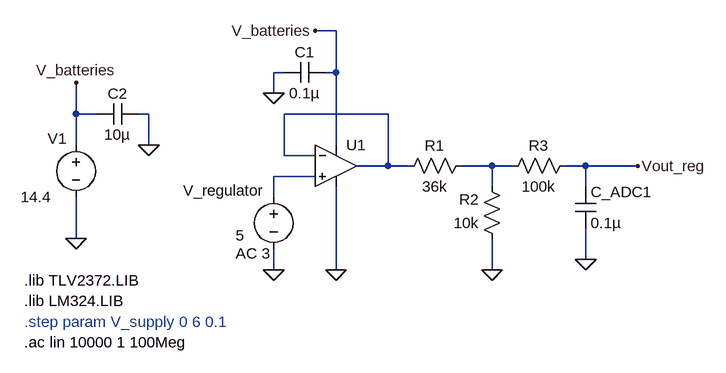
[diagram p0: schematic voltage_meaurementSINGLEregulator_optimised.asc]
voltage_meaurementSINGLEregulator_optimised.asc, the LTspice schematic file:
Version 4
SHEET 1 988 680
WIRE 256 -80 224 -80
WIRE 176 -16 160 -16
WIRE 256 -16 256 -80
WIRE 256 -16 240 -16
WIRE 160 16 160 -16
WIRE -144 48 -144 0
WIRE -112 48 -144 48
WIRE -32 48 -48 48
WIRE 336 48 176 48
WIRE -144 96 -144 48
WIRE -32 96 -32 48
WIRE 256 96 256 -16
WIRE 176 112 176 48
WIRE 224 112 176 112
WIRE 336 128 336 48
WIRE 336 128 288 128
WIRE 368 128 336 128
WIRE 496 128 448 128
WIRE 528 128 496 128
WIRE 640 128 608 128
WIRE 720 128 640 128
WIRE 224 144 160 144
WIRE 496 160 496 128
WIRE 640 160 640 128
WIRE 160 176 160 144
WIRE -144 240 -144 176
WIRE 640 272 640 224
WIRE 160 288 160 256
WIRE 256 288 256 160
WIRE 496 288 496 240
FLAG 720 128 Vout_reg
FLAG 224 -80 V_batteries
FLAG 256 288 0
FLAG 496 288 0
FLAG 160 288 0
FLAG 640 272 0
FLAG 160 16 0
FLAG -144 240 0
FLAG -144 0 V_batteries
FLAG -32 96 0
SYMBOL res 464 112 R90
WINDOW 0 0 56 VBottom 2
WINDOW 3 32 56 VTop 2
SYMATTR InstName R1
SYMATTR Value 36k
SYMATTR SpiceLine tol=1 pwr=0.6
SYMBOL res 512 256 R180
WINDOW 0 36 76 Left 2
WINDOW 3 36 40 Left 2
SYMATTR InstName R2
SYMATTR Value 10k
SYMATTR SpiceLine tol=1 pwr=0.6
SYMBOL OpAmps\\opamp2 256 64 R0
WINDOW 3 16 96 Invisible 2
SYMATTR InstName U1
SYMATTR Value2 TLV2372
SYMBOL voltage 160 160 R0
WINDOW 0 -14 6 Right 2
WINDOW 3 -58 75 Left 2
WINDOW 123 -58 103 Left 2
WINDOW 39 0 0 Left 0
SYMATTR InstName V_regulator
SYMATTR Value 5
SYMATTR Value2 AC 3
SYMBOL cap 624 160 R0
SYMATTR InstName C_ADC1
SYMATTR Value 0.1µ
SYMBOL res 624 112 R90
WINDOW 0 0 56 VBottom 2
WINDOW 3 32 56 VTop 2
SYMATTR InstName R3
SYMATTR Value 100k
SYMBOL cap 240 -32 R90
WINDOW 0 0 32 VBottom 2
WINDOW 3 32 32 VTop 2
SYMATTR InstName C1
SYMATTR Value 0.1µ
SYMBOL voltage -144 80 R0
WINDOW 0 -14 6 Right 2
WINDOW 3 -85 96 Left 2
WINDOW 123 0 0 Left 0
WINDOW 39 0 0 Left 0
SYMATTR InstName V1
SYMATTR Value 14.4
SYMBOL cap -48 32 R90
WINDOW 0 0 32 VBottom 2
WINDOW 3 32 32 VTop 2
SYMATTR InstName C2
SYMATTR Value 10µ
TEXT -224 368 Left 2 ;.step param V_supply 0 6 0.1
TEXT -224 304 Left 2 !.lib TLV2372.LIB
TEXT -224 336 Left 2 !.lib LM324.LIB
TEXT -224 400 Left 2 !.ac lin 10000 1 100Meg

The netlist it stands for:
* voltage_meaurementSINGLEregulator_optimised.asc
R1 N002 N001 36k tol=1 pwr=0.6
R2 0 N002 10k tol=1 pwr=0.6
XU1 N003 N001 V_batteries 0 N001 opamp2 TLV2372  ; pins In+ In- V+ V- OUT
V_regulator N003 0 5 AC 3
C_ADC1 Vout_reg 0 0.1µ
R3 Vout_reg N002 100k
C1 V_batteries 0 0.1µ
V1 V_batteries 0 14.4
C2 0 V_batteries 10µ
* .step param V_supply 0 6 0.1
.lib TLV2372.LIB
.lib LM324.LIB
.ac lin 10000 1 100Meg
.backanno
.end